# Altium schematic sheet MPU_HMC.SchDoc
size A
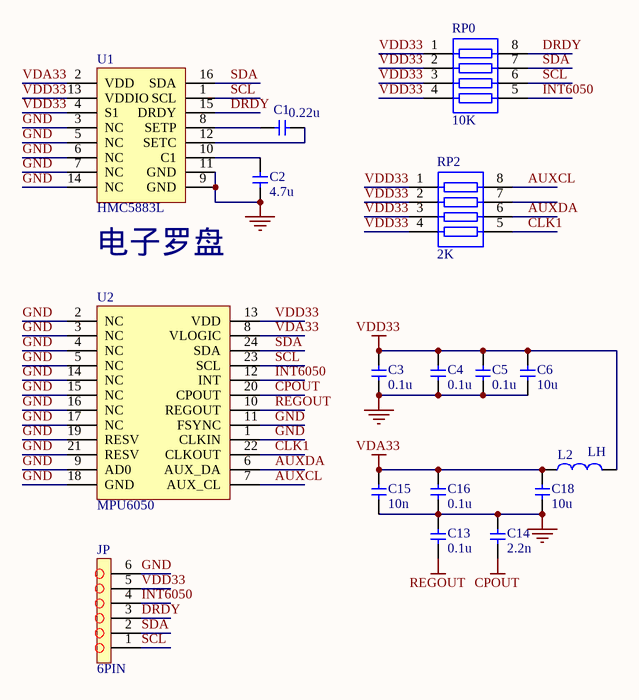
[diagram p0: MPU_HMC.SchDoc]

## Parts
C1  0.22u  [RC100]
C2  4.7u  [RC100]
C3  0.1u  [RC100]
C4  0.1u  [RC100]
C5  0.1u  [RC100]
C6  10u  [RC100]
C13  0.1u  [RC100]
C14  2.2n  [RC100]
C15  10n  [RC100]
C16  0.1u  [RC100]
C18  10u  [RC100]
JP  6PIN  [SIP6]
L2  LH  [1206]
RP0  10K  [RN4]
RP2  2K  [RN4]
U1  HMC5883L  [LPCC-16]
U2  MPU6050  [QFN-24]

## Nets
CPOUT: C14.1 U2.20(CPOUT)
GND: C2.1 C3.1 C4.1 C5.2 C6.2 C13.2 C14.2 C15.1 C16.2 C18.2 JP.6 U1.3(NC) U1.5(NC) U1.6(NC) U1.7(NC) U1.9(GND) U1.11(GND) U1.14(NC) U2.1(CLKIN) U2.2(NC) U2.3(NC) U2.4(NC) U2.5(NC) U2.9(AD0) U2.11(FSYNC) U2.14(NC) U2.15(NC) U2.16(NC) U2.17(NC) U2.18(GND) U2.19(RESV) U2.21(RESV)
REGOUT: C13.1 U2.10(REGOUT)
VDA33: C15.2 C16.1 C18.1 L2.1 U1.2(VDD) U2.8(VLOGIC)
VDD33: C3.2 C4.2 C5.1 C6.1 JP.5 L2.2 RP0.1 RP0.2 RP0.3 RP0.4 RP2.1 RP2.2 RP2.3 RP2.4 U1.4(S1) U1.13(VDDIO) U2.13(VDD)
AUXCL: RP2.8 U2.7(AUX_CL)
AUXDA: RP2.6 U2.6(AUX_DA)
CLK1: RP2.5 U2.22(CLKOUT)
DRDY: JP.3 RP0.8 U1.15(DRDY)
INT6050: JP.4 RP0.5 U2.12(INT)
SCL: JP.1 RP0.6 U1.1(SCL) U2.23(SCL)
SDA: JP.2 RP0.7 U1.16(SDA) U2.24(SDA)
NetC1_1: C1.1 U1.8(SETP)
NetC1_2: C1.2 U1.12(SETC)
NetC2_2: C2.2 U1.10(C1)

Not connected (* = marked no-connect by the designer): RP2 7

## Notes on the sheet
- 电子罗盘

## Library data of the parts
C1-C6 C13-C16 C18 = CAPA
RP0 RP2 = RESPACK4